# Altium schematic sheet usb_isolation.SchDoc: P4 - Controller - USB Isolator
size Letter; CompanyName: Brinton Engineering, LLC; DrawnBy: J. Brinton; Engineer: J. Brinton; Address1: 3479 Edison Way; Address2: Menlo Park CA 94025; Address3: +1 (877) 778-8435; Address4: brintonengineering.com; Revision: 1; SheetNumber: 1; SheetTotal: 1
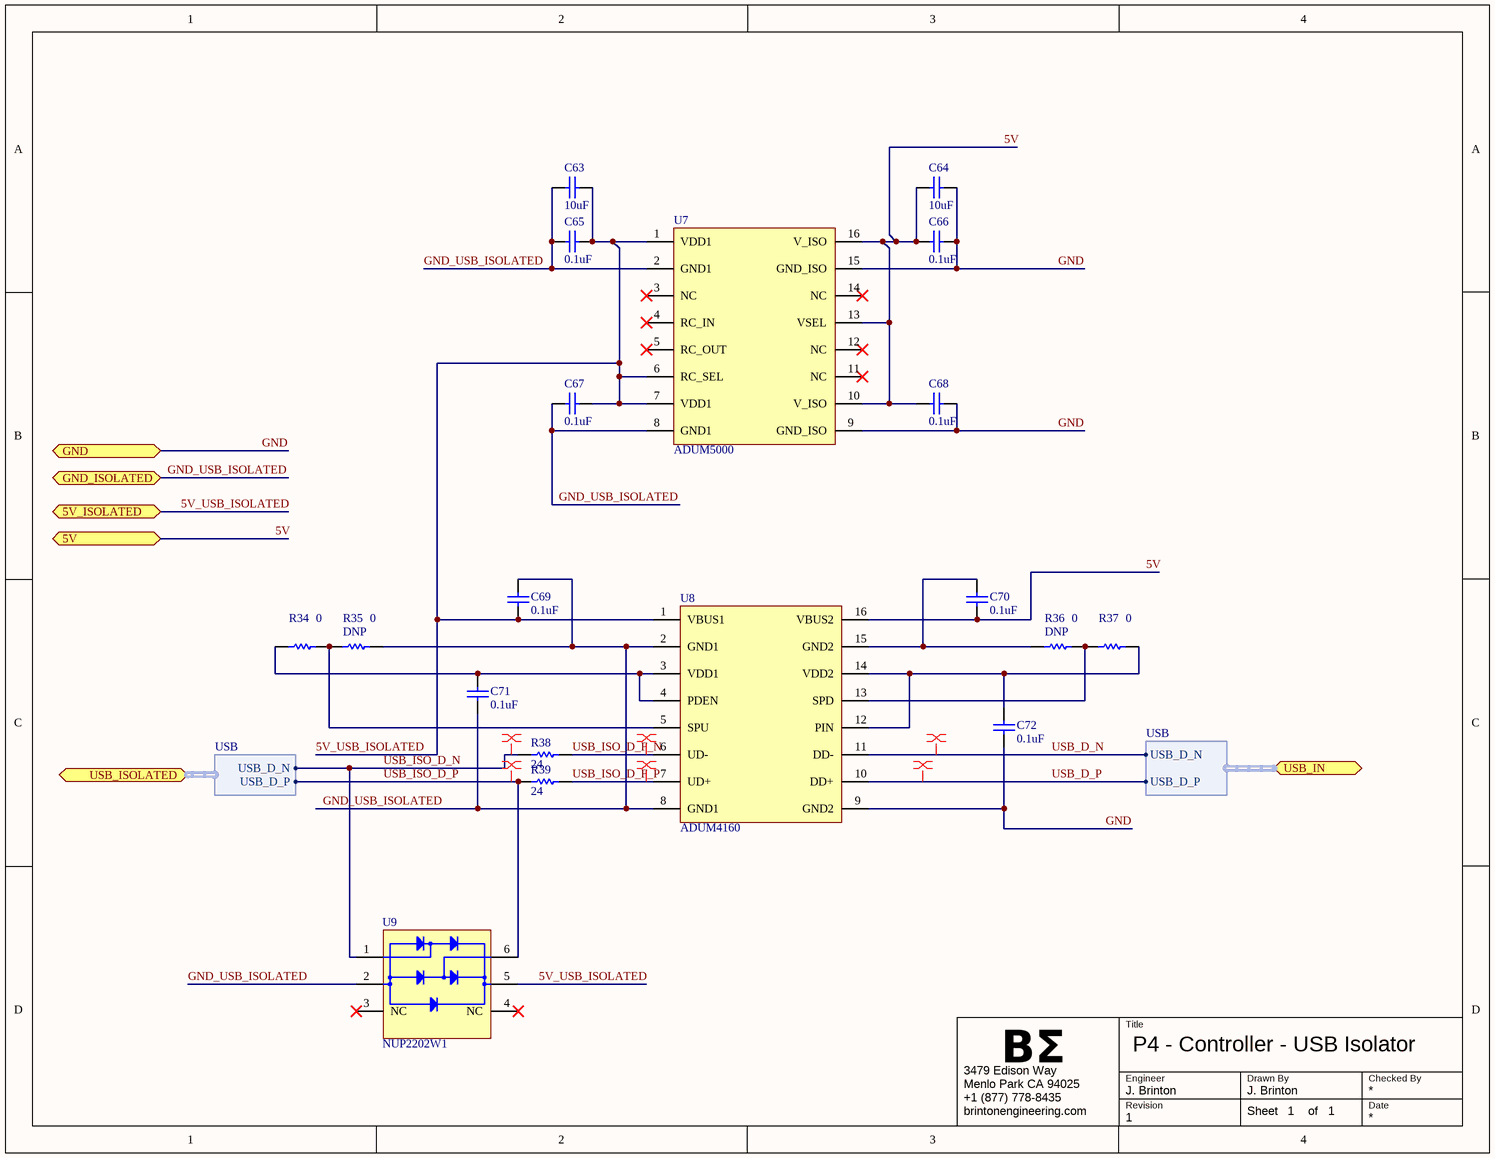
[diagram p0: usb_isolation.SchDoc]

## Parts
C63  value 10uF  [0805]  (hidden comment: CAP)
C64  value 10uF  [0805]  (hidden comment: CAP)
C65  value 0.1uF  [0805]  (hidden comment: CAP)
C66  value 0.1uF  [0805]  (hidden comment: CAP)
C67  value 0.1uF  [0805]  (hidden comment: CAP)
C68  value 0.1uF  [0805]  (hidden comment: CAP)
C69  value 0.1uF  [0805]  (hidden comment: CAP)
C70  value 0.1uF  [0805]  (hidden comment: CAP)
C71  value 0.1uF  [0805]  (hidden comment: CAP)
C72  value 0.1uF  [0805]  (hidden comment: CAP)
R34  value 0  [0805]  (hidden comment: RES 0805 0 2A)
R35  value 0  Do Not Populate: DNP  [0805]  (hidden comment: RES 0805 0 2A)
R36  value 0  Do Not Populate: DNP  [0805]  (hidden comment: RES 0805 0 2A)
R37  value 0  [0805]  (hidden comment: RES 0805 0 2A)
R38  value 24  [0805]  (hidden comment: RES 0805 24 +/-0.5% +/-50TCR)
R39  value 24  [0805]  (hidden comment: RES 0805 24 +/-0.5% +/-50TCR)
U7  ADUM5000  [soic16w_m]
U8  ADUM4160  [SOIC16W_M]
U9  NUP2202W1  [SOT363]

## Ports
5V, 5V_ISOLATED, GND, GND_ISOLATED, USB_IN (harness USB), USB_ISOLATED (harness USB)

## Harnesses
USB: USB_D_P, USB_D_N

## Nets
5V: C64.1 C66.1 C68.2 C70.1 U7.10(V_ISO) U7.13(VSEL) U7.16(V_ISO) U8.16(VBUS2) ; port 5V
5V_USB_ISOLATED: C63.2 C65.1 C67.1 C69.1 U7.1(VDD1) U7.6(RC_SEL) U7.7(VDD1) U8.1(VBUS1) U9.5(VP) ; port 5V_ISOLATED
GND: C64.2 C66.2 C68.1 C72.1 U7.9(GND_ISO) U7.15(GND_ISO) U8.9(GND2) ; port GND
GND_USB_ISOLATED: C63.1 C65.2 C67.2 C69.2 C71.1 R35.2 U7.2(GND1) U7.8(GND1) U8.2(GND1) U8.8(GND1) U9.2(VN) ; port GND_ISOLATED
USB_D_N: U8.11(DD-) ; port USB_IN.USB_D_N
USB_D_P: U8.10(DD+) ; port USB_IN.USB_D_P
USB_ISO_D_F_N: R38.2 U8.6(UD-)
USB_ISO_D_F_P: R39.2 U8.7(UD+)
USB_ISO_D_N: R38.1 U9.1(I/O) ; port USB_ISOLATED.USB_D_N
USB_ISO_D_P: R39.1 U9.6(I/O) ; port USB_ISOLATED.USB_D_P
NetC70_2: C70.2 R36.1 U8.15(GND2)
NetC71_2: C71.2 R34.1 U8.3(VDD1) U8.4(PDEN)
NetC72_2: C72.2 R37.2 U8.12(PIN) U8.14(VDD2)
NetR34_2: R34.2 R35.1 U8.5(SPU)
NetR36_2: R36.2 R37.1 U8.13(SPD)

Not connected (* = marked no-connect by the designer): U7 3(NC)* 4(RC_IN)* 5(RC_OUT)* 11(NC)* 12(NC)* 14(NC)*; U9 3(NC)* 4(NC)*

## Layout directives
differential pair: USB_D_N, USB_D_P, USB_ISO_D_F_N, USB_ISO_D_F_P, USB_ISO_D_N, USB_ISO_D_P

## Notes on the sheet
- Title
- Engineer
- Revision
- Drawn By
- Checked By
- Date
- Sheet
- of

## Library data of the parts
C63 C64 = CAP: Ceramic Capacitor 10uF +/-10% 50V X7S SMD 1210; Manufacturer: TDK Corporation; Manufacturer P/N: C3225X7S1H106K; Tr: [-55:125]; Tolerance: +/-10%; Voltage: 50V; Distributor: DigiKey; Distributor P/N: *
C65-C72 = CAP: Ceramic Capacitor 0.1uF +/-10% 50V X7R SMD 0805; Manufacturer: Murata Electronics; Manufacturer P/N: GRM21BR71H104KA01L; Tr: [-55:125]; Tolerance: +/-10%; Voltage: 50V; Distributor: DigiKey; Distributor P/N: *
R34-R37 = ERJ6GEY0R00V: Thick Film Chip Resistor 0 Ohms 2A SMD 0805; Manufacturer: Panasonic - ECG; Tr: -55:+70; Tcr: *; Tolerance: *; Manufacturer P/N: ERJ6GEY0R00V; Alternatives: *; Voltage: *; Power: *; P/N: ERJ6GEY0R00V
R38 R39 = ERA6AHD240V: Thin Film Chip Resistor 24 Ohms +/-0.5% 0.125W 100V SMD 0805; Manufacturer: Yageo; Manufacturer P/N: RT0805DRE0724RL; Tcr: +/-50; Tr: -55:+155; Tolerance: +/-0.5%; Alternatives: *; Voltage: 100V; Power: 0.125W; P/N: RT0805DRE0724RL
U7 = ADUM5000: Isolated DC/DC Converter; Manufacturer P/N: ADUM5000ARWZ; Manufacturer: Analog Devices; Distributor P/N: ADUM5000ARWZ-RLCT-ND; Distributor: DigiKey
U8 = ADUM4160: Full/Low Speed 5kV USB Digital Isolator; Manufacturer P/N: ADU4160BRWZ; Manufacturer: Analog Devices; Distributor P/N: ADUM4160BRWZ-RLCT-ND; Distributor: DigiKey
U9 = NUP2202W1: Transient Voltage Suppressor; Manufacturer P/N: NUP2202W1T2G; Manufacturer: On Semiconductor; Distributor: Arrow NAC; Distributor P/N: NUP2202W1T2G